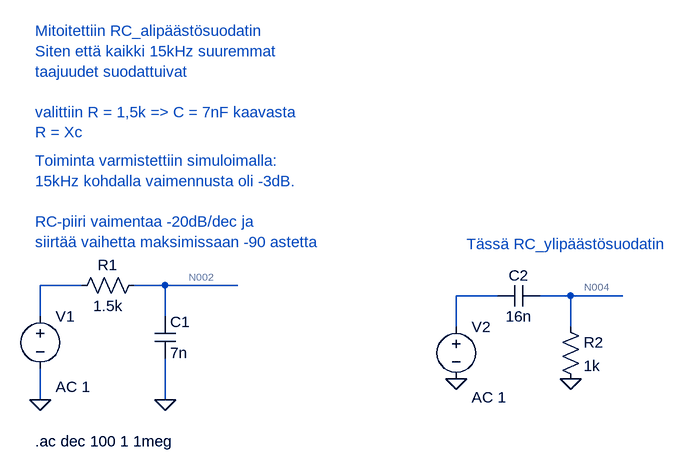
[diagram p0: schematic HT_teht5.asc]
HT_teht5.asc, the LTspice schematic file:
Version 4
SHEET 1 884 680
WIRE -384 224 -448 224
WIRE -256 224 -304 224
WIRE -144 224 -256 224
WIRE 256 240 192 240
WIRE 368 240 320 240
WIRE 448 240 368 240
WIRE -448 272 -448 224
WIRE -256 272 -256 224
WIRE 192 288 192 240
WIRE 368 288 368 240
WIRE -448 400 -448 352
WIRE -256 400 -256 336
FLAG -448 400 0
FLAG -256 400 0
FLAG 192 368 0
FLAG 368 368 0
SYMBOL res -288 208 R90
WINDOW 0 0 56 VBottom 2
WINDOW 3 32 56 VTop 2
SYMATTR InstName R1
SYMATTR Value 1.5k
SYMBOL cap -272 272 R0
SYMATTR InstName C1
SYMATTR Value 7n
SYMBOL voltage -448 256 R0
WINDOW 123 24 124 Left 2
WINDOW 39 0 0 Left 2
SYMATTR Value2 AC 1
SYMATTR InstName V1
SYMATTR Value ""
SYMBOL voltage 192 272 R0
WINDOW 123 24 124 Left 2
WINDOW 39 0 0 Left 2
SYMATTR Value2 AC 1
SYMATTR InstName V2
SYMATTR Value ""
SYMBOL cap 320 224 R90
WINDOW 0 0 32 VBottom 2
WINDOW 3 32 32 VTop 2
SYMATTR InstName C2
SYMATTR Value 16n
SYMBOL res 352 272 R0
SYMATTR InstName R2
SYMATTR Value 1k
TEXT -456 464 Left 2 !.ac dec 100 1 1meg
TEXT -456 -168 Left 2 ;Mitoitettiin RC_alipäästösuodatin\nSiten että kaikki 15kHz suuremmat\ntaajuudet suodattuivat\n \nvalittiin R = 1,5k => C = 7nF kaavasta\nR = Xc
TEXT -456 32 Left 2 ;Toiminta varmistettiin simuloimalla:\n15kHz kohdalla vaimennusta oli -3dB.\n \nRC-piiri vaimentaa -20dB/dec ja\nsiirtää vaihetta maksimissaan -90 astetta
TEXT 208 160 Left 2 ;Tässä RC_ylipäästösuodatin

The netlist it stands for:
* HT_teht5.asc
R1 N002 N001 1.5k
C1 N002 0 7n
V1 N001 0 AC 1
V2 N003 0 AC 1
C2 N004 N003 16n
R2 N004 0 1k
.ac dec 100 1 1meg
* Mitoitettiin RC_alipäästösuodatin
* Siten että kaikki 15kHz suuremmat
* taajuudet suodattuivat
* valittiin R = 1,5k => C = 7nF kaavasta
* R = Xc
* Toiminta varmistettiin simuloimalla:
* 15kHz kohdalla vaimennusta oli -3dB.
* RC-piiri vaimentaa -20dB/dec ja
* siirtää vaihetta maksimissaan -90 astetta
* Tässä RC_ylipäästösuodatin
.backanno
.end

* Results of the author's LTspice run, read from the files saved beside the schematic
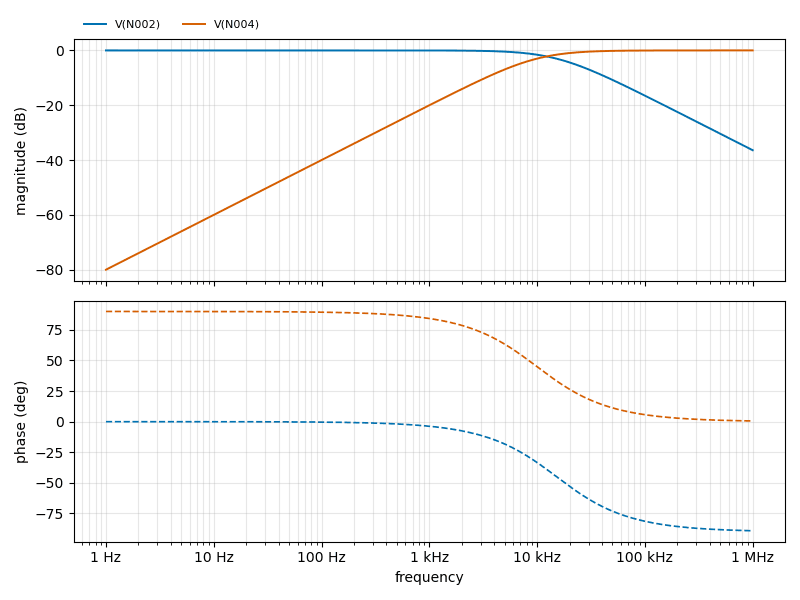
[diagram p1: AC Analysis of HT_teht5.asc, plotted from the saved traces]
* AC Analysis, 1 run:
*   V(N002): -0.00 dB at 1 Hz, -36.39 dB at 1 MHz, peak -0.00 dB at 1 Hz, 3 dB below the peak at 15.16 kHz
*   V(N004): -79.95 dB at 1 Hz, -0.00 dB at 1 MHz, peak -0.00 dB at 1 MHz, 3 dB below the peak at 9.947 kHz